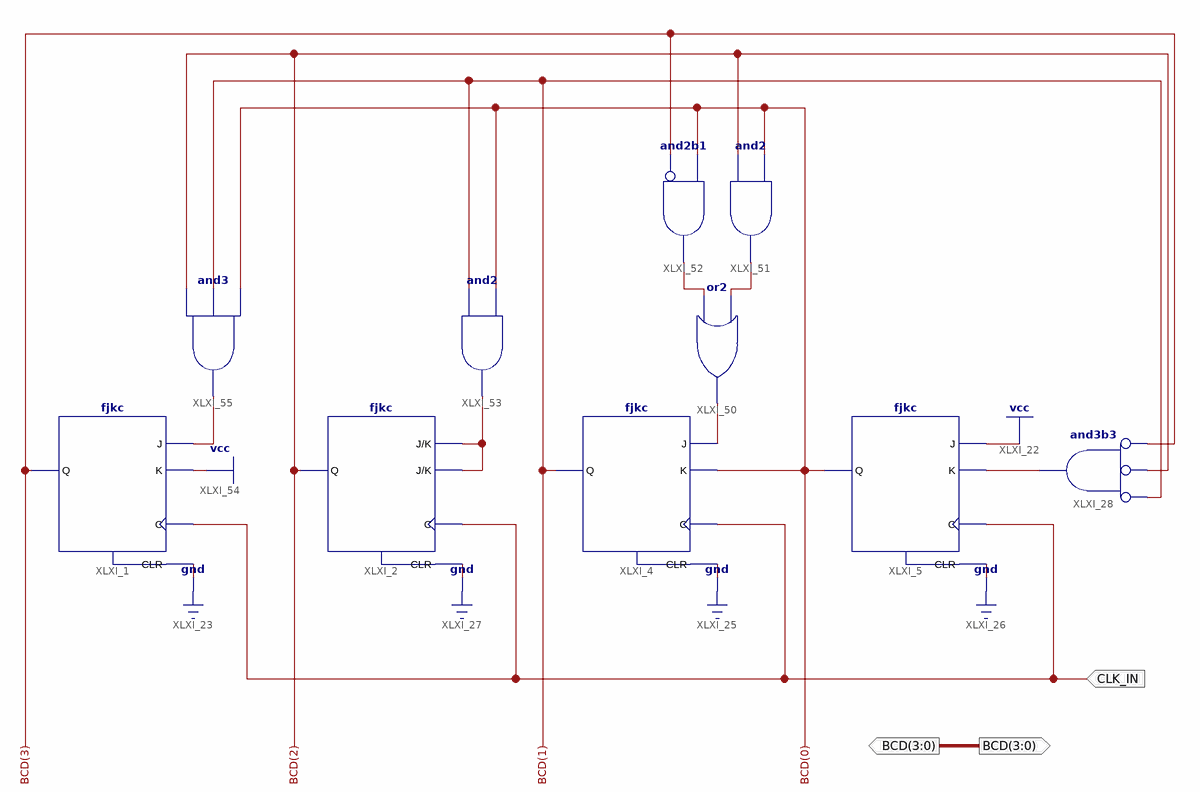
[diagram p0: schematic sheet 1]
// Xilinx ISE schematic CountExcept0648.sch (spartan6) as structural Verilog: 10 symbols, 2 ports
module CountExcept0648 (
  input  CLK_IN,
  output [3:0] BCD
);

  wire XLXN_9, XLXN_43, XLXN_44, XLXN_47, XLXN_49, XLXN_51;

  fjkc XLXI_1 (.C(CLK_IN), .CLR(1'b0), .J(XLXN_51), .K(1'b1), .Q(BCD[3]));
  fjkc XLXI_2 (.C(CLK_IN), .CLR(1'b0), .J(XLXN_49), .K(XLXN_49), .Q(BCD[2]));
  fjkc XLXI_5 (.C(CLK_IN), .CLR(1'b0), .J(1'b1), .K(XLXN_9), .Q(BCD[0]));
  and XLXI_28 (XLXN_9, ~BCD[1], ~BCD[2], ~BCD[3]);  // and3b3
  fjkc XLXI_4 (.C(CLK_IN), .CLR(1'b0), .J(XLXN_43), .K(BCD[0]), .Q(BCD[1]));
  or XLXI_50 (XLXN_43, XLXN_47, XLXN_44);
  and XLXI_51 (XLXN_44, BCD[2], BCD[0]);
  and XLXI_52 (XLXN_47, ~BCD[3], BCD[0]);  // and2b1
  and XLXI_53 (XLXN_49, BCD[1], BCD[0]);
  and XLXI_55 (XLXN_51, BCD[2], BCD[1], BCD[0]);
endmodule
